# Altium schematic sheet 2_MCU.SchDoc
size 444 x 304 mm; SheetNumber: 2; SheetTotal: 4
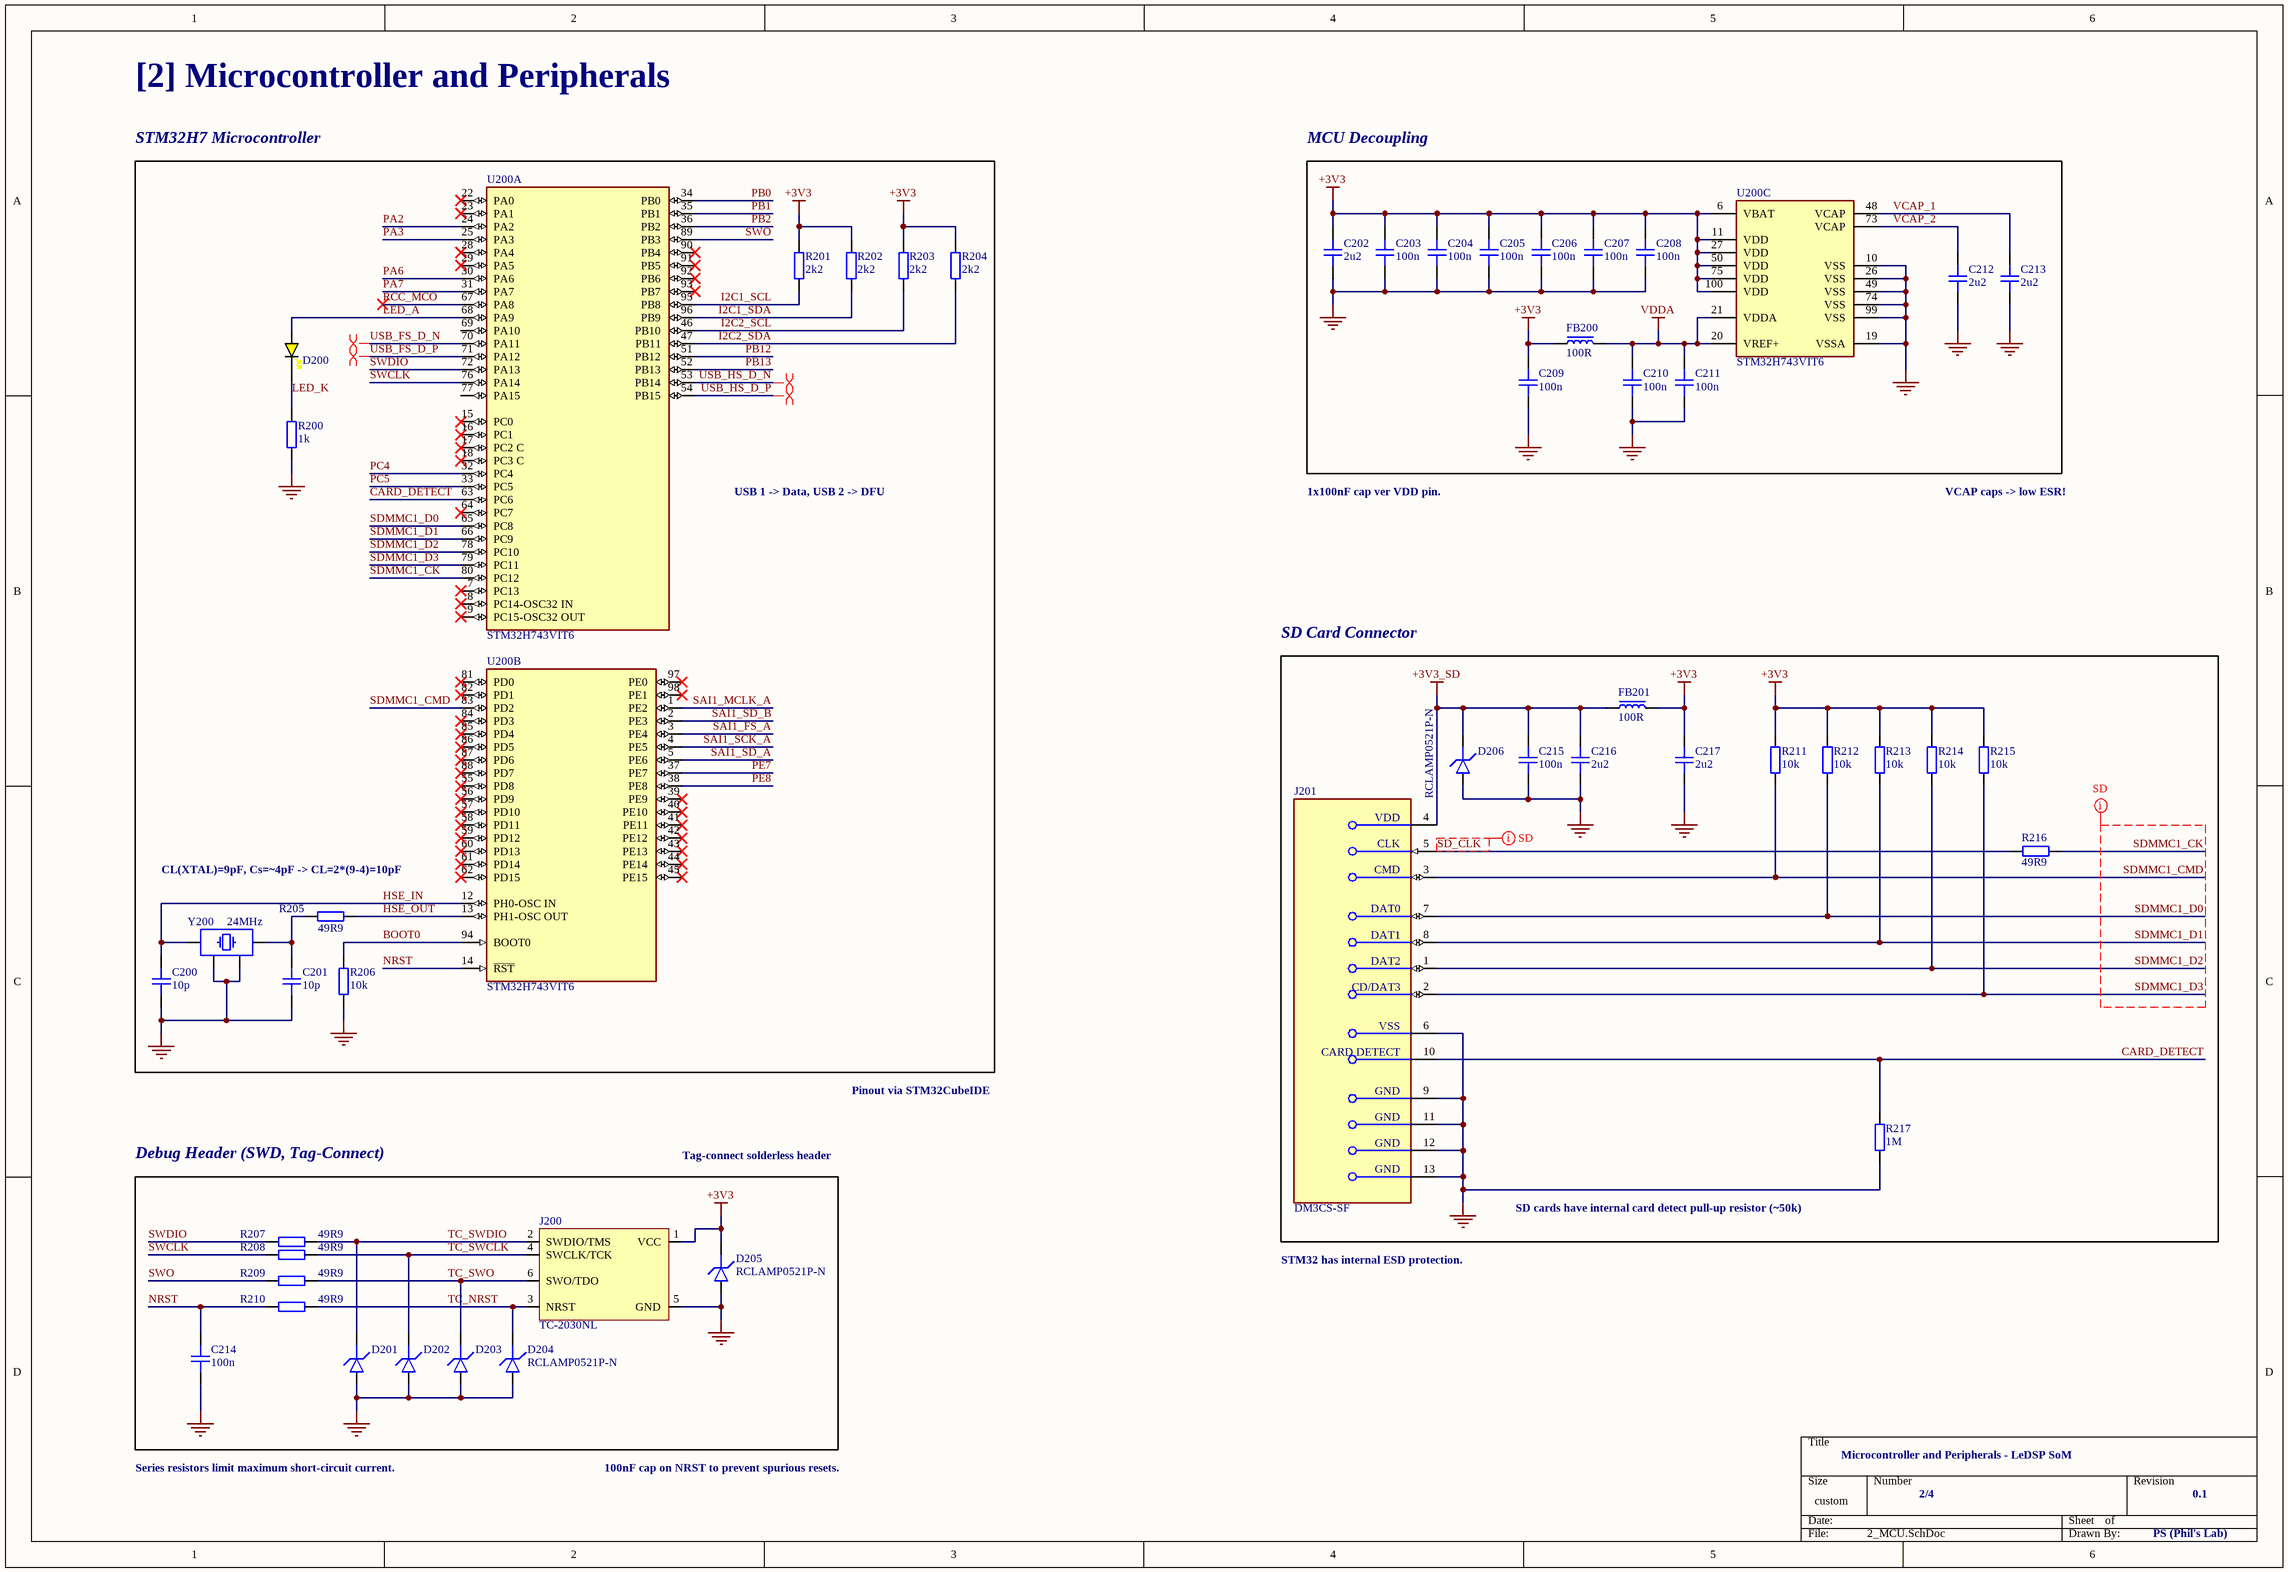
[diagram p0: 2_MCU.SchDoc]

## Parts
C200  10p  [CAP_0402]
C201  10p  [CAP_0402]
C202  2u2  [CAP_0603]
C203  100n  [CAP_0402]
C204  100n  [CAP_0402]
C205  100n  [CAP_0402]
C206  100n  [CAP_0402]
C207  100n  [CAP_0402]
C208  100n  [CAP_0402]
C209  100n  [CAP_0402]
C210  100n  [CAP_0402]
C211  100n  [CAP_0402]
C212  2u2  [CAP_0402]
C213  2u2  [CAP_0402]
C214  100n  [CAP_0402]
C215  100n  [CAP_0402]
C216  2u2  [CAP_0603]
C217  2u2  [CAP_0603]
D200  YELLOW  [LED_0402_YELLOW]  (value not drawn)
D201  RCLAMP0521P-N  [D_0402]  (value not drawn)
D202  RCLAMP0521P-N  [D_0402]  (value not drawn)
D203  RCLAMP0521P-N  [D_0402]  (value not drawn)
D204  RCLAMP0521P-N  [D_0402]
D205  RCLAMP0521P-N  [D_0402]
D206  RCLAMP0521P-N  [D_0402]
FB200  100R  [FB_0603]
FB201  100R  [FB_0603]
J200  TC-2030NL  [TC2030-NL-FP]
J201  DM3CS-SF  [FP-DM3CS-SF-MFG]
R200  1k  [RES_0402]
R201  2k2  [RES_0402]
R202  2k2  [RES_0402]
R203  2k2  [RES_0402]
R204  2k2  [RES_0402]
R205  49R9  [RES_0402]
R206  10k  [RES_0402]
R207  49R9  [RES_0402]
R208  49R9  [RES_0402]
R209  49R9  [RES_0402]
R210  49R9  [RES_0402]
R211  10k  [RES_0402]
R212  10k  [RES_0402]
R213  10k  [RES_0402]
R214  10k  [RES_0402]
R215  10k  [RES_0402]
R216  49R9  [RES_0402]
R217  1M  [RES_0402]
U200  STM32H743VIT6  [FP-LQFP100-1L-MFG]  (parts A,B,C of 3)
Y200  24MHz  [XTAL_3225]

## Blocks framed on the sheet
STM32H7 Microcontroller: C200 C201 D200 R200-R206 U200 Y200
MCU Decoupling: C202-C213 FB200 U200
SD Card Connector: C215-C217 D206 FB201 J201 R211-R217
Debug Header (SWD, Tag-Connect): C214 D201-D205 J200 R207-R210

## Nets
+3V3: C202.2 C203.2 C204.2 C205.2 C206.2 C207.2 C208.2 C209.2 C217.2 D205.K FB200.1 FB201.2 J200.1(VCC) R201.2 R202.2 R203.2 R204.2 R211.2 R212.2 R213.2 R214.2 R215.2 U200.6(VBAT) U200.11(VDD) U200.27(VDD) U200.50(VDD) U200.75(VDD) U200.100(VDD)
+3V3_SD: C215.2 C216.2 D206.K FB201.1 J201.4(VDD)
GND: C200.1 C201.1 C202.1 C203.1 C204.1 C205.1 C206.1 C207.1 C208.1 C209.1 C210.1 C211.1 C212.1 C213.1 C214.1 C215.1 C216.1 C217.1 D201.A D202.A D203.A D204.A D205.A D206.A J200.5(GND) J201.6(VSS) J201.9(GND) J201.11(GND) J201.12(GND) J201.13(GND) R200.1 R206.1 R217.1 U200.10(VSS) U200.19(VSSA) U200.26(VSS) U200.49(VSS) U200.74(VSS) U200.99(VSS) Y200.2 Y200.4
VDDA: C210.2 C211.2 FB200.2 U200.20(VREF+) U200.21(VDDA)
BOOT0: R206.2 U200.94(BOOT0)
CARD_DETECT: J201.10(CARD_DETECT) R217.2 U200.63(PC6)
HSE_IN: C200.2 U200.12(PH0-OSC_IN) Y200.1
HSE_OUT: R205.2 U200.13(PH1-OSC_OUT)
I2C1_SCL: R201.1 U200.95(PB8)
I2C1_SDA: R202.1 U200.96(PB9)
I2C2_SCL: R203.1 U200.46(PB10)
I2C2_SDA: R204.1 U200.47(PB11)
LED_A: D200.A U200.68(PA9)
LED_K: D200.K R200.2
NRST: C214.2 R210.1 U200.14(~{RST})
PA2: U200.24(PA2)
PA3: U200.25(PA3)
PA6: U200.30(PA6)
PA7: U200.31(PA7)
PB0: U200.34(PB0)
PB1: U200.35(PB1)
PB2: U200.36(PB2)
PB12: U200.51(PB12)
PB13: U200.52(PB13)
PC4: U200.32(PC4)
PC5: U200.33(PC5)
PE7: U200.37(PE7)
PE8: U200.38(PE8)
RCC_MCO: U200.67(PA8)
SAI1_FS_A: U200.3(PE4)
SAI1_MCLK_A: U200.1(PE2)
SAI1_SCK_A: U200.4(PE5)
SAI1_SD_A: U200.5(PE6)
SAI1_SD_B: U200.2(PE3)
SD_CLK: J201.5(CLK) R216.1
SDMMC1_CK: R216.2 U200.80(PC12)
SDMMC1_CMD: J201.3(CMD) R211.1 U200.83(PD2)
SDMMC1_D0: J201.7(DAT0) R212.1 U200.65(PC8)
SDMMC1_D1: J201.8(DAT1) R213.1 U200.66(PC9)
SDMMC1_D2: J201.1(DAT2) R214.1 U200.78(PC10)
SDMMC1_D3: J201.2(CD/DAT3) R215.1 U200.79(PC11)
SWCLK: R208.1 U200.76(PA14)
SWDIO: R207.1 U200.72(PA13)
SWO: R209.1 U200.89(PB3)
TC_NRST: D204.K J200.3(NRST) R210.2
TC_SWCLK: D202.K J200.4(SWCLK/TCK) R208.2
TC_SWDIO: D201.K J200.2(SWDIO/TMS) R207.2
TC_SWO: D203.K J200.6(SWO/TDO) R209.2
USB_FS_D_N: U200.70(PA11)
USB_FS_D_P: U200.71(PA12)
USB_HS_D_N: U200.53(PB14)
USB_HS_D_P: U200.54(PB15)
VCAP_1: C213.2 U200.48(VCAP)
VCAP_2: C212.2 U200.73(VCAP)
NetC201_2: C201.2 R205.1 Y200.3

Not connected (* = marked no-connect by the designer): U200 7(PC13)* 8(PC14-OSC32_IN)* 9(PC15-OSC32_OUT)* 15(PC0)* 16(PC1)* 17(PC2_C)* 18(PC3_C)* 22(PA0)* 23(PA1)* 28(PA4)* 29(PA5)* 39(PE9)* 40(PE10)* 41(PE11)* 42(PE12)* 43(PE13)* 44(PE14)* 45(PE15)* 55(PD8)* 56(PD9)* 57(PD10)* 58(PD11)* 59(PD12)* 60(PD13)* 61(PD14)* 62(PD15)* 64(PC7)* 69(PA10) 77(PA15) 81(PD0)* 82(PD1)* 84(PD3)* 85(PD4)* 86(PD5)* 87(PD6)* 88(PD7)* 90(PB4)* 91(PB5)* 92(PB6)* 93(PB7)* 97(PE0)* 98(PE1)*

## Layout directives
net class SD: SD_CLK, SDMMC1_CK, SDMMC1_CMD, SDMMC1_D0, SDMMC1_D1, SDMMC1_D2, SDMMC1_D3
differential pair; differential pair class DIFF_USB: USB_FS_D_N, USB_FS_D_P, USB_HS_D_N, USB_HS_D_P

## Notes on the sheet
- [2] Microcontroller and Peripherals
- USB 1 -> Data, USB 2 -> DFU
- 1x100nF cap ver VDD pin.
- VCAP caps -> low ESR!
- (near R205) CL(XTAL)=9pF, Cs=~4pF -> CL=2*(9-4)=10pF
- Pinout via STM32CubeIDE
- Tag-connect solderless header
- STM32 has internal ESD protection.
- SD cards have internal card detect pull-up resistor (~50k)
- Microcontroller and Peripherals - LeDSP SoM
- Series resistors limit maximum short-circuit current.
- 100nF cap on NRST to prevent spurious resets.
- 2/4
- 0.1
- PS (Phil's Lab)

## Library data of the parts
C200 C201 C203-C215 = CAP_0402_16V: Capacitor SMD 0402 16V
C202 C216 C217 = CAP_0603_16V: Capacitor SMD 0603 16V
D200 = LED_0402_YELLOW: LED 0402 YELLOW SMD
D201-D206 = D_TVS_0402: Diode TVS / ESD 0402
FB200 FB201 = FB_0603: Ferrite Bead SMD 0603
J200 = TC2030-NL: Tag-Connect No-Solder SWD Debug Connector (No Legs) DO NOT PLACE; Manufacturer: Tag-Connect; Manfucaturer Number: TC2030-NL-FP
J201 = CMP-11597-000003-1: CONN MICRO SD CARD HINGED TYPE; Pitch: 1.1mm; Connector Type: Connector; Current Rating: 500mA; Voltage Rating (AC): 125V; Gender: Female; Insulation Resistance: 1GR; Number of Positions: 8; Contact Resistance: 100mR; Packaging: Tape and Reel; Flammability Rating: UL94 V-0; Lead Free: Lead Free; Min Operating Temperature: -25°C; Orientation: Right Angle; Width: 13.8mm; Number of Rows: 1; Housing Material: Polymer; Package Quantity: 1; Mount: Surface Mount; Max Current Rating: 500mA; Radiation Hardening: No; Max Operating Temperature: 85°C; Contact Plating: Gold; Depth: 1.83mm; Contact Material: Gold; Length: 14.1mm; Number of Contacts: 8; Termination: Solder
R200-R217 = RES_0402: Resistor SMD 0402
U200 = CMP-12105-000050-1: IC MCU 32BIT 2MB FLASH 100LQFP; Manufacturer: STMicroelectronics; Number Of Ethernet Channels: 1; Number Of Usb Channels: 2; Number Of A/D Converters: 3; Min Supply Voltage: 1.71V; Ram Size: 1060KBytes; Number Of I2C Channels: 4; Frequency: 480MHz; Number Of Adc Channels: 36; Number Of I/Os: 82; Max Supply Voltage: 3.6V; Number Of Spi Channels: 6; Memory Size: 2MBytes; Max Junction Temp: +125°C; Core Architecture: Arm Cortex-M7; Interface: I2C,SPI,UART,USART,USB,LIN,IrDA,Ethernet,I2S,Other; Number Of Timers/Counters: 20; Data Bus Width: 32bits; Number Of Pwm Channels: 42; Number Of Uart Channels: 9; Standoff Height: 0.05mm; Device Class L1: Integrated Circuits (ICs); ComponentLink2URL: https://www.st.com/resource/en/datasheet/stm32h743vi.pdf; Automotive: No; Memory Type: FLASH; Number Of Cores: 1; Temperature Range Low: -40°C; RoHS: TRUE; Ambient Temperature Range Low: -40°C; ComponentLink2Description: Datasheet; Device Class L2: Embedded Processors and Controllers; Device Class L3: Microcontrollers; Digikey Description: IC MCU 32BIT 2MB FLASH 100LQFP; Temperature Range High: +125°C; Ambient Temperature Range High: +85°C; Package: LQFP100-1L; Temperature: -40°C to +125°C; Category: IC; Ipc Land Pattern Name: QFP50P1600X1600X160-100; Height: 1.6mm; Manufacturer Part Number: STM32H743VIT6; Octopart: https://octopart.com/stm32h743vit6-stmicroelectronics-76372527; Lead Free: Yes
Y200 = TSX-3225_24.0000MF15X-AC: Crystal SMD 24MHz 10PPM 7pF 3225; Manufacturer: Epson; Manufacturer Number: TSX-3225 24.0000MF15X-AC; ESR: 40R; Value: 24MHz; Type: XTAL; Load Capacitance: 7pF